# Altium schematic sheet CubeSat Backplane.SchDoc: PWA, CUBESAT BACKPLANE
size B; DrawnBy: C. Kornowski; Engineer: C. Kornowski; Organization: SIERRA LOBO TDEC; Address1: 11401 HOOVER RD; Address2: MILAN OH  44846; DocumentNumber: RD17-7000; Revision: INIT; SheetNumber: 1; SheetTotal: 5; PageSetup: Record=PageOptions|CenterHorizontal=True|CenterVertical=True|PrintScale=1.09|XCorrection=1.00|YCorrection=1.00|PrintKind=1|BorderSize=5000000|LeftOffset=0|BottomOffset=0|Orientation=2|PaperLength=1000|PaperWidth=1000|Scale=100|PaperSource=7|PrintQuality=600|MediaType=1|DitherType=10|PaperKind=11x17|PrintScaleMode=1
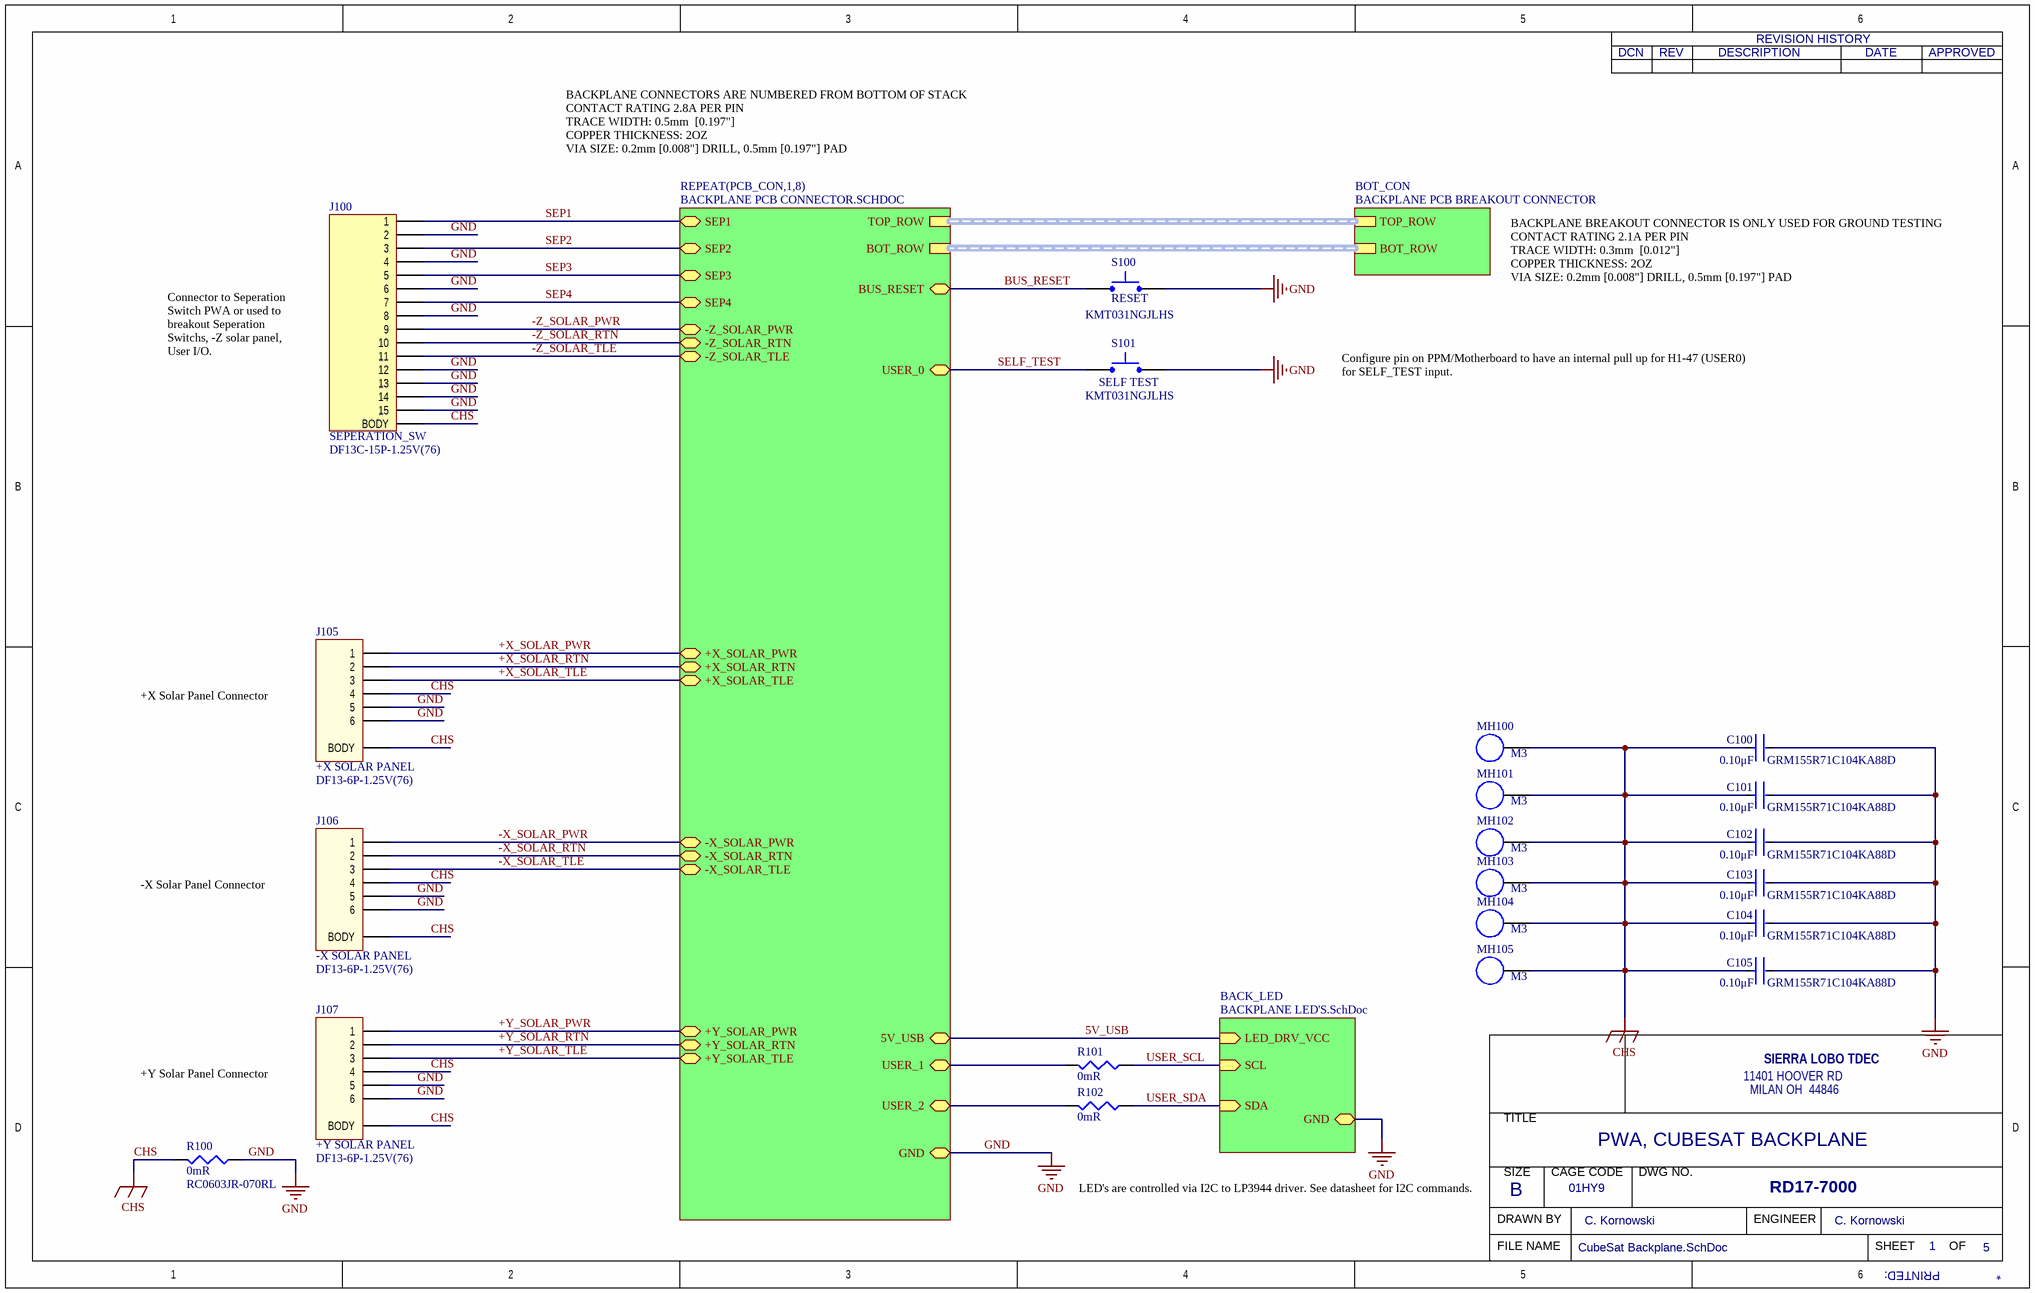
[diagram p0: CubeSat Backplane.SchDoc]

## Parts
C100  GRM155R71C104KA88D  Capacitance: 0.10μF  [FP-GRM15-MFG]
C101  GRM155R71C104KA88D  Capacitance: 0.10μF  [FP-GRM15-MFG]
C102  GRM155R71C104KA88D  Capacitance: 0.10μF  [FP-GRM15-MFG]
C103  GRM155R71C104KA88D  Capacitance: 0.10μF  [FP-GRM15-MFG]
C104  GRM155R71C104KA88D  Capacitance: 0.10μF  [FP-GRM15-MFG]
C105  GRM155R71C104KA88D  Capacitance: 0.10μF  [FP-GRM15-MFG]
J100  SEPERATION_SW  Manufacturer Part Number: DF13C-15P-1.25V(76)  [DF13-15P-1.25H(75)]
J105  +X SOLAR PANEL  [DF13-6P-1.25V(75)]
J106  -X SOLAR PANEL  [DF13-6P-1.25V(75)]
J107  +Y SOLAR PANEL  [DF13-6P-1.25V(75)]
MH100  M3  [M3_NPTH/W PAD]  (no BOM)
MH101  M3  [M3_NPTH/W PAD]  (no BOM)
MH102  M3  [M3_NPTH/W PAD]  (no BOM)
MH103  M3  [M3_NPTH/W PAD]  (no BOM)
MH104  M3  [M3_NPTH/W PAD]  (no BOM)
MH105  M3  [M3_NPTH/W PAD]  (no BOM)
R100  0mR  Manufacturer Part Number 1: RC0603JR-070RL  [0603]
R101  0mR  [0603]
R102  0mR  [0603]
S100  RESET  Manufacturer Part Number 1: KMT031NGJLHS  [KMT031 NGJ LHS]
S101  SELF TEST  Manufacturer Part Number 1: KMT031NGJLHS  [KMT031 NGJ LHS]

## Sub-sheets
BACK_LED = BACKPLANE LED'S.SchDoc: SCL (in), SDA (in), LED_DRV_VCC (in), GND (bidir)
BOT_CON = BACKPLANE PCB BREAKOUT CONNECTOR: TOP_ROW (harness TOP), BOT_ROW (harness BOT)
REPEAT(PCB_CON,1,8) = BACKPLANE PCB CONNECTOR.SCHDOC: BOT_ROW (harness BOT), TOP_ROW (harness TOP), GND (bidir), BUS_RESET (bidir), USER_0 (bidir), SEP1 (bidir), SEP2 (bidir), SEP3 (bidir), SEP4 (bidir), -Z_SOLAR_PWR (bidir), -Z_SOLAR_RTN (bidir), -Z_SOLAR_TLE (bidir), +X_SOLAR_PWR (bidir), +X_SOLAR_RTN (bidir), +X_SOLAR_TLE (bidir), -X_SOLAR_PWR (bidir), -X_SOLAR_RTN (bidir), -X_SOLAR_TLE (bidir), +Y_SOLAR_PWR (bidir), +Y_SOLAR_RTN (bidir), +Y_SOLAR_TLE (bidir), 5V_USB (bidir), USER_1 (bidir), USER_2 (bidir)

## Nets
CHS: C100.2 C101.2 C102.2 C103.2 C104.2 C105.2 J100.B(BODY) J105.4 J105.B(BODY) J106.4 J106.B(BODY) J107.4 J107.B(BODY) MH100.MH MH101.MH MH102.MH MH103.MH MH104.MH MH105.MH R100.2
GND: C100.1 C101.1 C102.1 C103.1 C104.1 C105.1 J100.2 J100.4 J100.6 J100.8 J100.12 J100.13 J100.14 J100.15 J105.5 J105.6 J106.5 J106.6 J107.5 J107.6 R100.1 S100.2 S101.2 ; sheet REPEAT(PCB_CON,1,8)/GND, sheet BACK_LED/GND
5V_USB: sheet REPEAT(PCB_CON,1,8)/5V_USB, sheet BACK_LED/LED_DRV_VCC
+X_SOLAR_PWR: J105.1 ; sheet REPEAT(PCB_CON,1,8)/+X_SOLAR_PWR
+X_SOLAR_RTN: J105.2 ; sheet REPEAT(PCB_CON,1,8)/+X_SOLAR_RTN
+X_SOLAR_TLE: J105.3 ; sheet REPEAT(PCB_CON,1,8)/+X_SOLAR_TLE
+Y_SOLAR_PWR: J107.1 ; sheet REPEAT(PCB_CON,1,8)/+Y_SOLAR_PWR
+Y_SOLAR_RTN: J107.2 ; sheet REPEAT(PCB_CON,1,8)/+Y_SOLAR_RTN
+Y_SOLAR_TLE: J107.3 ; sheet REPEAT(PCB_CON,1,8)/+Y_SOLAR_TLE
-X_SOLAR_PWR: J106.1 ; sheet REPEAT(PCB_CON,1,8)/-X_SOLAR_PWR
-X_SOLAR_RTN: J106.2 ; sheet REPEAT(PCB_CON,1,8)/-X_SOLAR_RTN
-X_SOLAR_TLE: J106.3 ; sheet REPEAT(PCB_CON,1,8)/-X_SOLAR_TLE
-Z_SOLAR_PWR: J100.9 ; sheet REPEAT(PCB_CON,1,8)/-Z_SOLAR_PWR
-Z_SOLAR_RTN: J100.10 ; sheet REPEAT(PCB_CON,1,8)/-Z_SOLAR_RTN
-Z_SOLAR_TLE: J100.11 ; sheet REPEAT(PCB_CON,1,8)/-Z_SOLAR_TLE
BUS_RESET: S100.1 ; sheet REPEAT(PCB_CON,1,8)/BUS_RESET
SELF_TEST: S101.1 ; sheet REPEAT(PCB_CON,1,8)/USER_0
SEP1: J100.1 ; sheet REPEAT(PCB_CON,1,8)/SEP1
SEP2: J100.3 ; sheet REPEAT(PCB_CON,1,8)/SEP2
SEP3: J100.5 ; sheet REPEAT(PCB_CON,1,8)/SEP3
SEP4: J100.7 ; sheet REPEAT(PCB_CON,1,8)/SEP4
USER_SCL: R101.1 ; sheet BACK_LED/SCL
USER_SDA: R102.1 ; sheet BACK_LED/SDA
NetR101_2: R101.2 ; sheet REPEAT(PCB_CON,1,8)/USER_1
NetR102_2: R102.2 ; sheet REPEAT(PCB_CON,1,8)/USER_2

## Buses and harness runs
harness sheet BOT_CON/BOT_ROW = sheet REPEAT(PCB_CON,1,8)/BOT_ROW
harness sheet BOT_CON/TOP_ROW = sheet REPEAT(PCB_CON,1,8)/TOP_ROW

## Notes on the sheet
- BACKPLANE CONNECTORS ARE NUMBERED FROM BOTTOM OF STACK
  CONTACT RATING 2.8A PER PIN
  TRACE WIDTH: 0.5mm  [0.197"]
  COPPER THICKNESS: 2OZ
  VIA SIZE: 0.2mm [0.008"] DRILL, 0.5mm [0.197"] PAD
- BACKPLANE BREAKOUT CONNECTOR IS ONLY USED FOR GROUND TESTING
  CONTACT RATING 2.1A PER PIN
  TRACE WIDTH: 0.3mm  [0.012"]
  COPPER THICKNESS: 2OZ
  VIA SIZE: 0.2mm [0.008"] DRILL, 0.5mm [0.197"] PAD
- Connector to Seperation Switch PWA or used to breakout Seperation Switchs, -Z solar panel, User I/O.
- Configure pin on PPM/Motherboard to have an internal pull up for H1-47 (USER0) for SELF_TEST input.
- +X Solar Panel Connector
- -X Solar Panel Connector
- +Y Solar Panel Connector
- LED's are controlled via I2C to LP3944 driver. See datasheet for I2C commands.
- DCN
- REV
- DESCRIPTION
- REVISION HISTORY
- DATE
- APPROVED
- SIZE
- TITLE
- CAGE CODE
- DWG NO.
- DRAWN BY
- B
- 01HY9
- ENGINEER
- FILE NAME
- SHEET
- PRINTED:
- OF

## Library data of the parts
C100-C105 = CMP-2100-03641-2: CAP CER 0.1UF 16V X7R 0402; Manufacturer: Murata; Standoff Height: 0mm; Tolerance: 10%; Voltage Rating: 16Vdc; Material: Ceramic; Value: 0.10μF; Insulation Resistance: 10GR; RoHS: TRUE; Manufacturer Part Number: GRM155R71C104KA88D; Temperature Characteristic: X7R; Octopart: https://octopart.com/grm155r71c104ka88d-murata-196880; Digikey Description: CAP CER 0.1UF 16V X7R 0402; Device Class L3: Ceramic Capacitors; Height: 0.55mm; ComponentLink2Description: Datasheet; Temperature Range Low: -55°C; Ipc Land Pattern Name: CAPC10050X219; ComponentLink2URL: https://search.murata.co.jp/Ceramy/image/img/A01X/G101/ENG/GRM155R71H471KA01-01A.pdf; Device Class L1: Passive Components; Lead Free: yes; Category: Cap; Package: GRM15; Temperature: -55°C to +125°C; Device Class L2: Capacitors; Temperature Range High: +125°C; Mouser Description: 0402 0.1 uF 16V ±10 % Tolerance X7R SMT Multilayer Ceramic Capacitor; Supplier 1: Digi-Key; Supplier Part Number 1: 490-3261-1-ND; Stock 1: 161805; Pricing 1: 1=0.10000, 10=0.02200, 50=0.01180, 100=0.00960, 500=0.00684, 1000=0.00538, 2500=0.00489, 5000=0.00450 (USD); Mount: Surface Mount; Case/Package: 0402; Number of Pins: 2; Case Code (Metric): 1005; Case Code (Imperial): 0402; Dielectric Material: Ceramic; Min Operating Temperature: -55°C; Max Operating Temperature: 125°C; Packaging: Tape and Reel; Package Quantity: 1; Dielectric: X7R; Termination: SMD/SMT; Voltage Rating (DC): 16V; Voltage: 16V; Length: 1mm; Width: 0.5mm; Depth: 0.5mm; Thickness: 0.022inch; Radiation Hardening: No; REACH SVHC: No SVHC; RoHS Compliant: Yes; ComponentLink1URL: https://datasheet.ciiva.com/129/grm155r71c104ka88-01-129739.pdf?src-supplier=Digi-Key; ComponentLink1Description: https://datasheet.ciiva.com/129/grm155r71c104ka88-01-129739.pdf?src-supplier=Digi-Key; ComponentLink3URL: https://datasheet.ciiva.com/129/grm155r71c104ka88-01-129740.pdf?src-supplier=Digi-Key; ComponentLink3Description: https://datasheet.ciiva.com/129/grm155r71c104ka88-01-129740.pdf?src-supplier=Digi-Key; ComponentLink4URL: https://datasheet.ciiva.com/18102/getdatasheetpartid-85307-18102905.pdf?src-supplier=Verical; ComponentLink4Description: https://datasheet.ciiva.com/18102/getdatasheetpartid-85307-18102905.pdf?src-supplier=Verical; ComponentLink5URL: https://datasheet.ciiva.com/29199/454098-da-01-en-vs-kondensator-0402-29199799.pdf?src-supplier=Conrad; ComponentLink5Description: https://datasheet.ciiva.com/29199/454098-da-01-en-vs-kondensator-0402-29199799.pdf?src-supplier=Conrad; ComponentLink6URL: https://datasheet.ciiva.com/14103/grmseries-highdielectrictype-eng-14103750.pdf?src-supplier=Distrelec; ComponentLink6Description: https://datasheet.ciiva.com/14103/grmseries-highdielectrictype-eng-14103750.pdf?src-supplier=Distrelec; ComponentLink7URL: https://datasheet.ciiva.com/14116/grmseries-highdielectrictype-eng-14116878.pdf?src-supplier=Distrelec; ComponentLink7Description: https://datasheet.ciiva.com/14116/grmseries-highdielectrictype-eng-14116878.pdf?src-supplier=Distrelec; ComponentLink8URL: https://datasheet.ciiva.com/16199/product-16199000.pdf?src-supplier=Future+Electronics; ComponentLink8Description: https://datasheet.ciiva.com/16199/product-16199000.pdf?src-supplier=Future+Electronics; ComponentLink9URL: https://datasheet.ciiva.com/28534/4360-28534127.pdf?src-supplier=Element14; ComponentLink9Description: https://datasheet.ciiva.com/28534/4360-28534127.pdf?src-supplier=Element14; ComponentLink10URL: https://datasheet.ciiva.com/28534/4360-28534133.pdf?src-supplier=Element14; ComponentLink10Description: https://datasheet.ciiva.com/28534/4360-28534133.pdf?src-supplier=Element14; ComponentLink11URL: https://datasheet.ciiva.com/7937/4360-7937615.pdf?src-supplier=Element14; ComponentLink11Description: https://datasheet.ciiva.com/7937/4360-7937615.pdf?src-supplier=Element14
J100 = DF13C-15P-1.25x: CONN HEADER SMD R/A 15POS 1.25MM; Manufacturer: Hirose; Connector Type: Header,Male Pin; Number of Positions: 15; Current Rating: 1A; Voltage Rating: 150V; Supplier 1: Digi-Key; RoHS: No; Category: Connectors; Stock 1: 228; Pricing 1: 1=1.61000, 20=1.46000, 80=1.25138, 440=1.04282, 960=0.89385, 4900=0.79255, 9800=0.77467 (USD); Mount: Surface Mount; Contact Plating: Gold; Contact Material: Brass; Contact Shape: Square; Insulation Material: Nylon; Insulation Color: Beige; Min Operating Temperature: -35°C; Max Operating Temperature: 85°C; Fastening Type: Detent; Packaging: Rail/Tube; Number of Rows: 1; Termination: Solder; Flammability Rating: UL94 V-0; ComponentLink1URL: https://www.hirose.com/product/en/download_file/key_name/DF13/category/Catalog/doc_file_id/31687/?file_category_id=4&amp;item_id=38&amp;is_series=1&src-supplier=Digi-Key; ComponentLink1Description: https://www.hirose.com/product/en/download_file/key_name/DF13/category/Catalog/doc_file_id/31687/?file_category_id=4&amp;item_id=38&amp;is_series=1&src-supplier=Digi-Key; Supplier 2: Digi-Key; Stock 2: 124; Pricing 2: 1=0.91000, 20=0.76700, 80=0.68888, 440=0.56359, 960=0.50096, 4900=0.43834, 9800=0.41642 (USD); RoHS Compliant: Yes; ComponentLink2URL: https://www.hirose.com/product/download/?distributor=digikey&amp;type=2d&amp;lang=en&amp;num=DF13-15P-1.25H(75)&src-supplier=Digi-Key; ComponentLink2Description: https://www.hirose.com/product/download/?distributor=digikey&amp;type=2d&amp;lang=en&amp;num=DF13-15P-1.25H(75)&src-supplier=Digi-Key; Supplier Part Number 1: H126460-ND; Supplier Part Number 2: H126385-ND
J105-J107 = DF13-6P-1.25V(76): CONN HEADER SMD 6POS 1.25MM; Manufacturer 1: Hirose; Supplier 1: Digi-Key; Supplier Part Number 1: H126413-ND; Stock 1: 484; Pricing 1: 1=0.90000, 10=0.79100, 100=0.68200, 500=0.55800, 1000=0.49600 (USD); RoHS: No; Manufacturer Part Number 1: DF13-6P-1.25V(76)
MH100-MH105 = Mounting Hole
R100 = RES1: RES SMD 0 OHM JUMPER 1/10W 0603; Manufacturer 1: Yageo; Tolerance: 1%; Voltage Rating: 50V; Power Rating: 100mW; Temperature Coefficient: 200ppm/°C; ComponentLink1URL: https://datasheet.ciiva.com/11808/pyu-r-int-6-11808700.pdf?src-supplier=RSComponents; ComponentLink1Description: https://datasheet.ciiva.com/11808/pyu-r-int-6-11808700.pdf?src-supplier=RSComponents; ComponentLink2URL: https://datasheet.ciiva.com/7746/1738695-7746421.pdf?src-supplier=Element14; ComponentLink2Description: https://datasheet.ciiva.com/7746/1738695-7746421.pdf?src-supplier=Element14; ComponentLink3URL: https://datasheet.ciiva.com/8883/pyu-rc0603-51-rohs-l-4-8883045.pdf?src-supplier=Avnet; ComponentLink3Description: https://datasheet.ciiva.com/8883/pyu-rc0603-51-rohs-l-4-8883045.pdf?src-supplier=Avnet; ComponentLink4URL: https://datasheet.ciiva.com/15189/getdatasheetpartid-329462-15189845.pdf?src-supplier=Verical; ComponentLink4Description: https://datasheet.ciiva.com/15189/getdatasheetpartid-329462-15189845.pdf?src-supplier=Verical; ComponentLink5URL: https://datasheet.ciiva.com/7746/1738695-7746422.pdf?src-supplier=Element14; ComponentLink5Description: https://datasheet.ciiva.com/7746/1738695-7746422.pdf?src-supplier=Element14; ComponentLink6URL: https://datasheet.ciiva.com/12555/rc0603-272842-12555254.pdf?src-supplier=Mouser; ComponentLink6Description: https://datasheet.ciiva.com/12555/rc0603-272842-12555254.pdf?src-supplier=Mouser; ComponentLink7URL: https://datasheet.ciiva.com/22747/443971-22747530.pdf?src-supplier=Element14; ComponentLink7Description: https://datasheet.ciiva.com/22747/443971-22747530.pdf?src-supplier=Element14; Supplier 1: Digi-Key; Supplier Part Number 1: 311-0.0GRCT-ND; Stock 1: 37679871; Pricing 1: 1=0.10000, 10=0.01800, 25=0.01320, 50=0.01000, 100=0.00730, 250=0.00560, 500=0.00448, 1000=0.00329 (USD); RoHS: Yes; Case/Package: 0603; Number of Pins: 2; Case Code (Imperial): 0603; Case Code (Metric): 1608; Contact Plating: Tin,Matte; Min Operating Temperature: -55°C; Max Operating Temperature: 155°C; Package Quantity: 5000; Value: 0mR; Packaging: Tape and Reel; Voltage Rating (DC): 50V; Termination: SMD/SMT; Composition: Thick Film; Military Standard: Not; Length: 1.6mm; Height: 0.45mm; Width: 0.8mm; Depth: 0.8mm; Radiation Hardening: No; REACH SVHC: No SVHC; Lead Free: Lead Free
R101 R102 = RES1: RES SMD 0 OHM JUMPER 1/10W 0603; Manufacturer 1: Yageo; Manufacturer Part Number 1: RC0603JR-070RL; Tolerance: 1%; Voltage Rating: 50V; Power Rating: 100mW; Temperature Coefficient: 200ppm/°C; ComponentLink1URL: https://datasheet.ciiva.com/11808/pyu-r-int-6-11808700.pdf?src-supplier=RSComponents; ComponentLink1Description: https://datasheet.ciiva.com/11808/pyu-r-int-6-11808700.pdf?src-supplier=RSComponents; ComponentLink2URL: https://datasheet.ciiva.com/7746/1738695-7746421.pdf?src-supplier=Element14; ComponentLink2Description: https://datasheet.ciiva.com/7746/1738695-7746421.pdf?src-supplier=Element14; ComponentLink3URL: https://datasheet.ciiva.com/8883/pyu-rc0603-51-rohs-l-4-8883045.pdf?src-supplier=Avnet; ComponentLink3Description: https://datasheet.ciiva.com/8883/pyu-rc0603-51-rohs-l-4-8883045.pdf?src-supplier=Avnet; ComponentLink4URL: https://datasheet.ciiva.com/15189/getdatasheetpartid-329462-15189845.pdf?src-supplier=Verical; ComponentLink4Description: https://datasheet.ciiva.com/15189/getdatasheetpartid-329462-15189845.pdf?src-supplier=Verical; ComponentLink5URL: https://datasheet.ciiva.com/7746/1738695-7746422.pdf?src-supplier=Element14; ComponentLink5Description: https://datasheet.ciiva.com/7746/1738695-7746422.pdf?src-supplier=Element14; ComponentLink6URL: https://datasheet.ciiva.com/12555/rc0603-272842-12555254.pdf?src-supplier=Mouser; ComponentLink6Description: https://datasheet.ciiva.com/12555/rc0603-272842-12555254.pdf?src-supplier=Mouser; ComponentLink7URL: https://datasheet.ciiva.com/22747/443971-22747530.pdf?src-supplier=Element14; ComponentLink7Description: https://datasheet.ciiva.com/22747/443971-22747530.pdf?src-supplier=Element14; Supplier 1: Digi-Key; Supplier Part Number 1: 311-0.0GRCT-ND; Stock 1: 37679871; Pricing 1: 1=0.10000, 10=0.01800, 25=0.01320, 50=0.01000, 100=0.00730, 250=0.00560, 500=0.00448, 1000=0.00329 (USD); RoHS: Yes; Case/Package: 0603; Number of Pins: 2; Case Code (Imperial): 0603; Case Code (Metric): 1608; Contact Plating: Tin,Matte; Min Operating Temperature: -55°C; Max Operating Temperature: 155°C; Package Quantity: 5000; Value: 0mR; Packaging: Tape and Reel; Voltage Rating (DC): 50V; Termination: SMD/SMT; Composition: Thick Film; Military Standard: Not; Length: 1.6mm; Height: 0.45mm; Width: 0.8mm; Depth: 0.8mm; Radiation Hardening: No; REACH SVHC: No SVHC; Lead Free: Lead Free
S100 S101 = Tactile_Switch: SWITCH TACTILE SPST-NO 0.05A 32V; Manufacturer 1: ITT C&K; Mechanical Life: 300000Cycles; Throw Configuration: SPST; Max Current Rating: 50mA; Operating Force: 3.4N; Power Rating: 500mW; Illumination Type: Non-Illuminated; Switch Travel: 0.15mm; Switch Function: Off-Mom; Actuator Type: Standard; Ratings: IP68,Waterproof,Dust Tight; Supplier 1: Future Electronics; Supplier Part Number 1: KMT031NGJLHS-CUTT; Stock 1: 20000; Pricing 1: 1=0.29500, 250=0.21500, 750=0.19900, 1500=0.19200, 2500=0.18600 (USD); RoHS: Yes; Mount: Surface Mount; Case/Package: SMD/SMT; Contact Material: Silver; Contact Plating: Silver; Min Operating Temperature: -40°C; Max Operating Temperature: 85°C; Packaging: Tape and Reel; Package Quantity: 1; Current Rating: 50mA; Voltage Rating (DC): 32V; Max Voltage Rating (DC): 32V; Termination: J-Lead; Orientation: Straight; Length: 2.6mm; Depth: 3.4mm; Radiation Hardening: No; REACH SVHC: No SVHC; ComponentLink1URL: https://datasheet.ciiva.com/2901/kmt-0xx-ngj-lhs-drawing-2901011.pdf?src-supplier=Digi-Key; ComponentLink1Description: https://datasheet.ciiva.com/2901/kmt-0xx-ngj-lhs-drawing-2901011.pdf?src-supplier=Digi-Key; ComponentLink2URL: https://datasheet.ciiva.com/2901/kmt-0xx-ngj-lhs-drawing-2901012.pdf?src-supplier=Digi-Key; ComponentLink2Description: https://datasheet.ciiva.com/2901/kmt-0xx-ngj-lhs-drawing-2901012.pdf?src-supplier=Digi-Key; ComponentLink3URL: https://datasheet.ciiva.com/2901/kmt-0xx-ngj-lhs-drawing-2901013.pdf?src-supplier=Digi-Key; ComponentLink3Description: https://datasheet.ciiva.com/2901/kmt-0xx-ngj-lhs-drawing-2901013.pdf?src-supplier=Digi-Key; ComponentLink4URL: https://datasheet.ciiva.com/22712/1443640-22712103.pdf?src-supplier=Element14; ComponentLink4Description: https://datasheet.ciiva.com/22712/1443640-22712103.pdf?src-supplier=Element14; ComponentLink5URL: https://datasheet.ciiva.com/18145/getdatasheetpartid-320373-18145244.pdf?src-supplier=Verical; ComponentLink5Description: https://datasheet.ciiva.com/18145/getdatasheetpartid-320373-18145244.pdf?src-supplier=Verical